# EAGLE schematic motor_PCB (EAGLE 8.6.0)
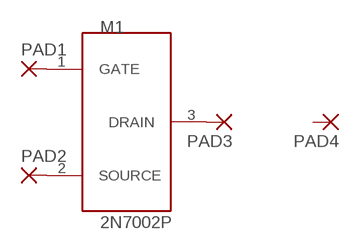
[diagram p0: schematic, sheet 1]

## Parts
M1  2N7002P  [TO-236AB]
PAD1  SMD2  [SMD1,27-2,54]
PAD2  SMD2  [SMD1,27-2,54]
PAD3  SMD2  [SMD1,27-2,54]
PAD4  SMD2  [SMD1,27-2,54]

## Nets
N$1: M1.1(GATE) PAD1.1(P)
N$2: M1.2(SOURCE) PAD2.1(P)
N$3: M1.3(DRAIN) PAD3.1(P)
Unconnected: PAD4.1(P)

## Library data of the parts
M1 = SeanSylwester:2N7002P
PAD1-PAD4 = wirepad:SMD2: SMD PAD